# EAGLE design eCog102_uSD (EAGLE 6.6.0)
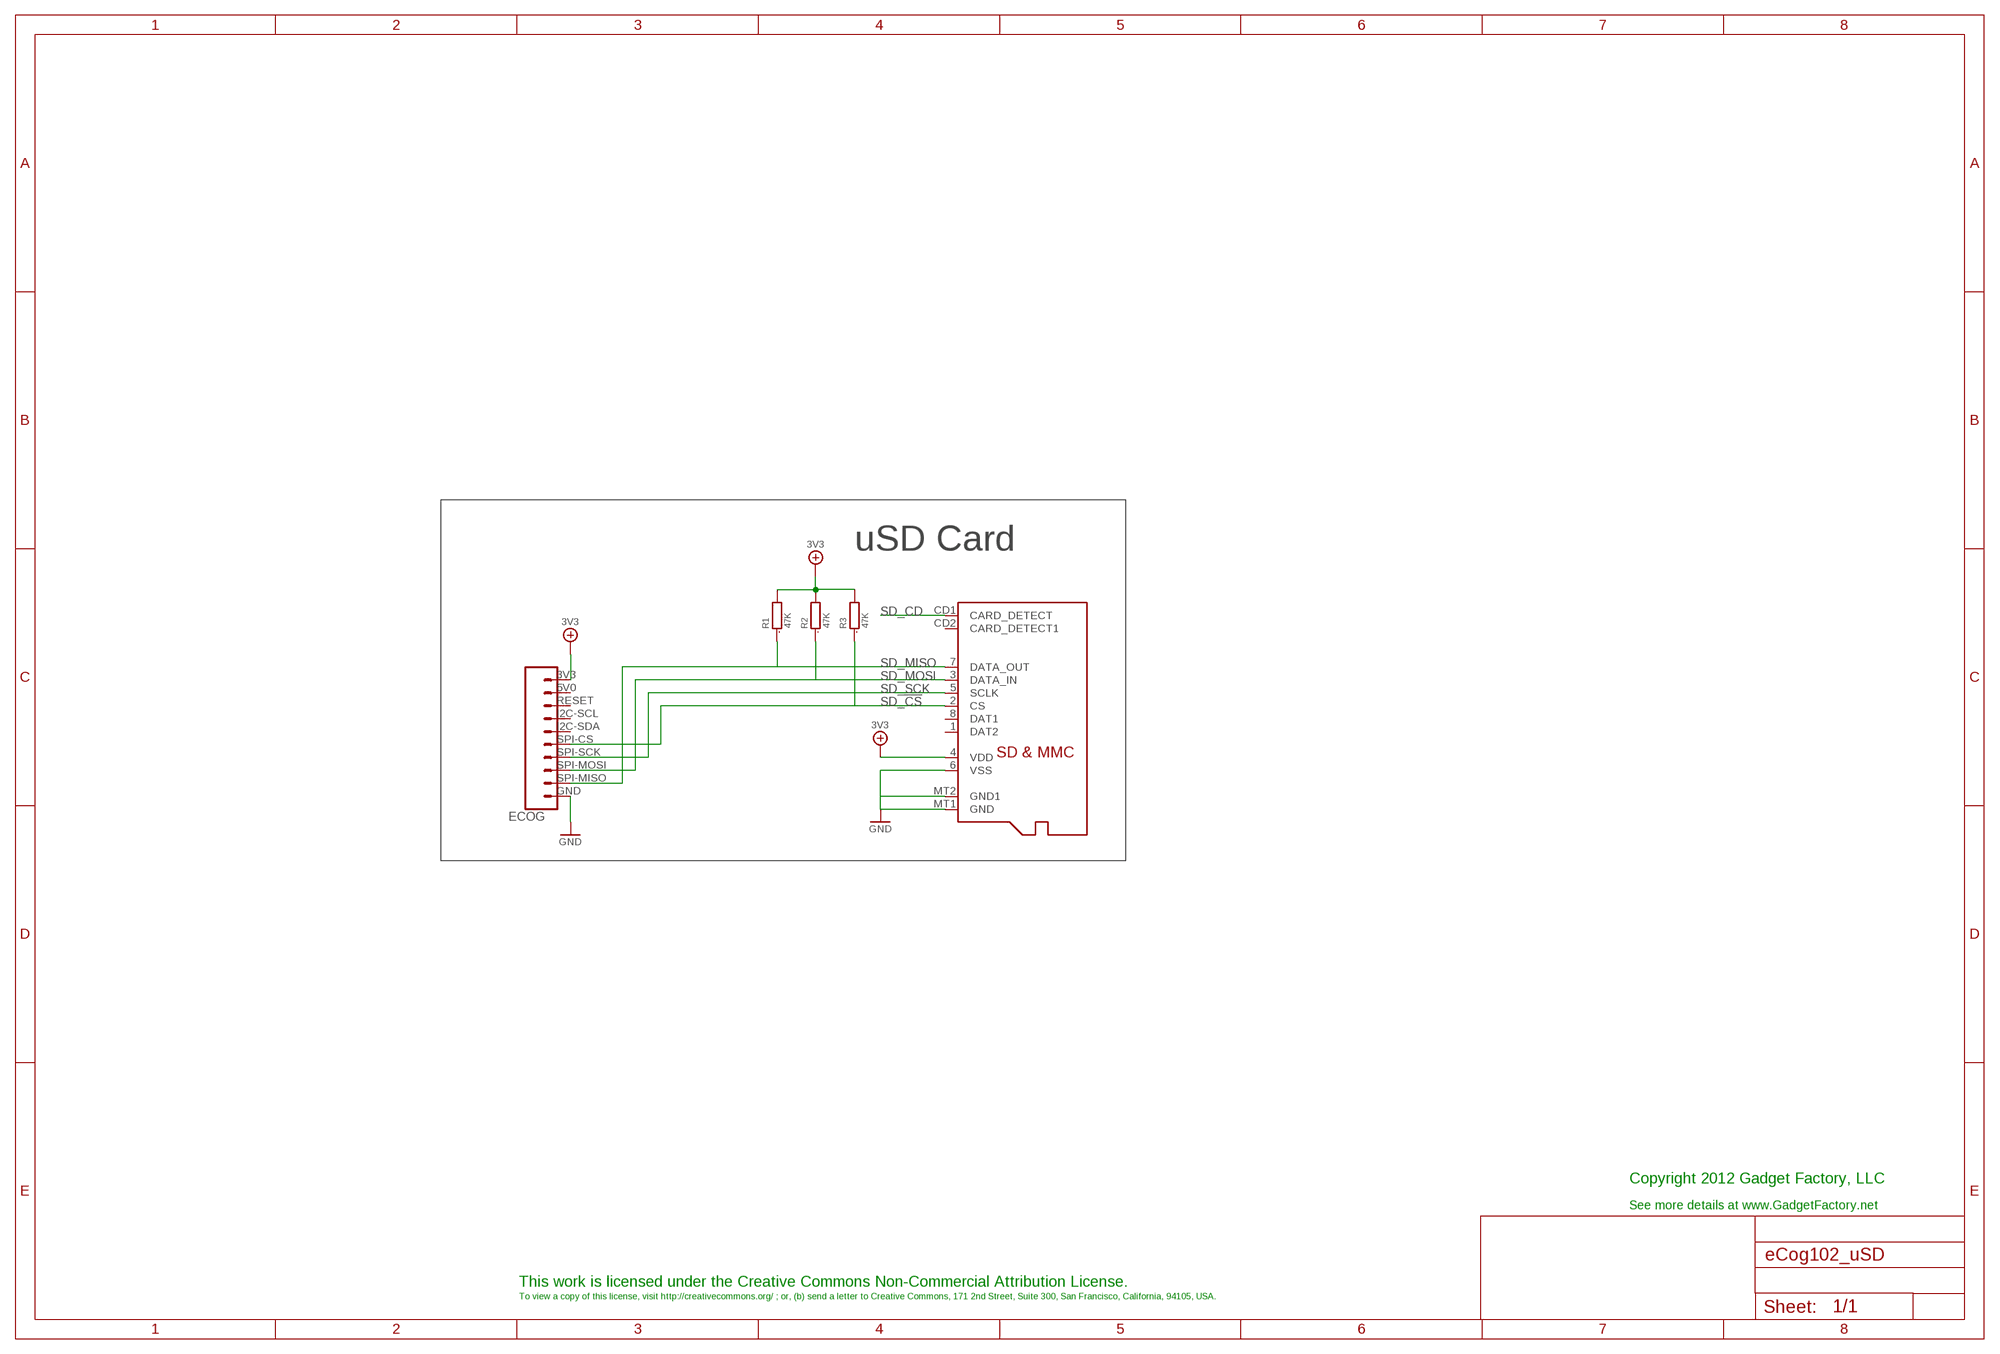
[diagram p0: schematic, sheet 1]

## Parts
ECOG  ECOG_BUSES_ROWTHROUGHHOLE  [ECOG_BUSES_TH]
R1  47K  R0805  [0805]
R2  47K  R0805  [0805]
R3  47K  R0805  [0805]
SD1  MICROSD  [MICROSD]

## Nets
3V3: ECOG.3V3 R1.2 R2.2 R3.2 SD1.4(VDD)
GND: ECOG.GND SD1.6(VSS) SD1.MT1(GND) SD1.MT2(GND1)
SD_!CS: ECOG.SPI-CS R3.1 SD1.2(CS)
SD_CD: SD1.CD1(CARD_DETECT)
SD_MISO: ECOG.SPI-MISO R1.1 SD1.7(DATA_OUT)
SD_MOSI: ECOG.SPI-MOSI R2.1 SD1.3(DATA_IN)
SD_SCK: ECOG.SPI-SCK SD1.5(SCLK)
Unconnected: ECOG.5V0(RSV) ECOG.I2C-SCL ECOG.I2C-SDA ECOG.RESET(RSV) SD1.1(DAT2) SD1.8(DAT1) SD1.CD2(CARD_DETECT1)

## Notes on the sheet
- uSD Card
- Copyright 2012 Gadget Factory, LLC
- See more details at www.GadgetFactory.net
- This work is licensed under the Creative Commons Non-Commercial Attribution License.
- To view a copy of this license, visit http://creativecommons.org/ ; or, (b) send a letter to Creative Commons, 171 2nd Street, Suite 300, San Francisco, California, 94105, USA.

## Library data of the parts
ECOG = eCogs:ECOG_BUSES_ROW
R1-R3 = GadgetFactory_6.0:R: RESISTOR, European symbol; DIGIKEY: RMCF0805JT47K0CT-ND; PARTNO: RMCF0805JT47K0
SD1 = adafruit:MICROSD: Micro-SD / Transflash card holder with SPI pinout For the 3M # 2908-05WB-MG and/or 4UCON #19656 push-push type; DIGIKEY: 101-00660-68-6-1-ND; PARTNO: 101-00660-68-6

## Board
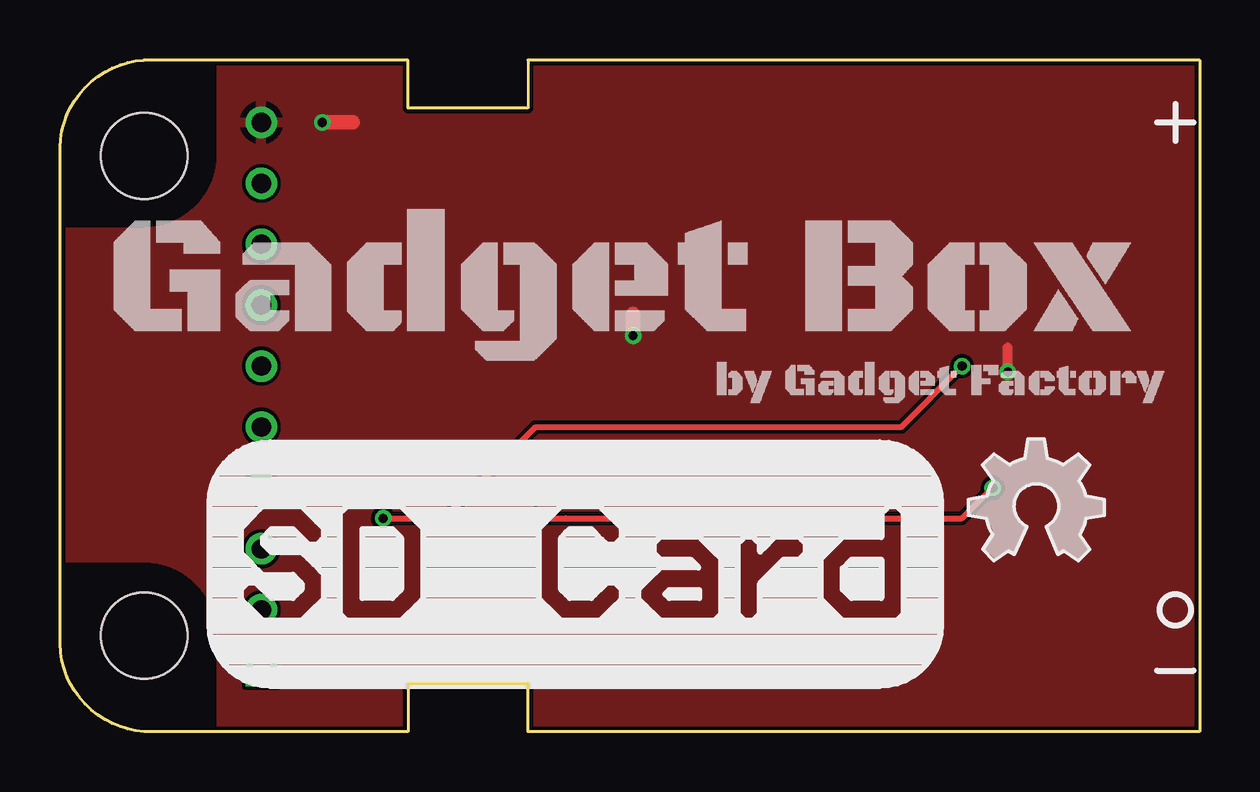
[diagram p1: board, top side]
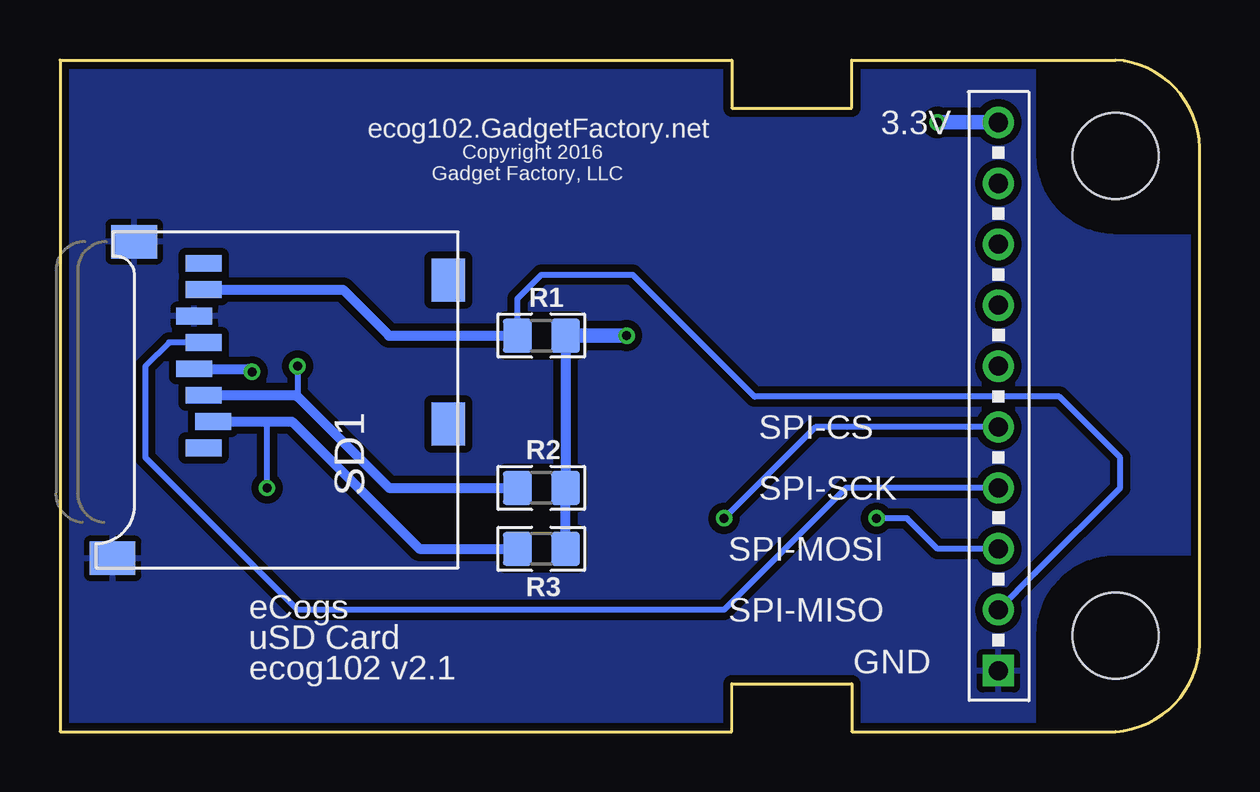
[diagram p2: board, bottom side, seen from below]

Size 47.51 x 28 mm. Coordinates in mm from the lower left corner, seen from the top.
Copper layers (1*16): Top 0.035mm / dielectric 1.5mm / Bottom 0.035mm
Design rules "hackvana": minimum track width 6mil, minimum drill 0.3mm, track to track 6mil, track to pad 6mil, pad to pad 6mil, via to via 6mil, smd to smd 0mil, copper to edge 6mil, drill to drill 6mil, minimum pad ring 10mil, minimum via ring 6mil, stop-mask expansion 2mil, vias tented up to drill 100mil, thermal gap 10mil

### Footprints (pad centres in the part's own frame; a part is rotated, then mirrored left to right if it is on the bottom)
ECOG_BUSES_TH = drill 0.8: 3V3 8.89,25.4; 5V0 8.89,22.86; I2C-SCL 8.89,17.78; I2C-SDA 8.89,15.24; RESET 8.89,20.32; SPI-CS 8.89,12.7; SPI-MISO 8.89,5.08; SPI-MOSI 8.89,7.62; SPI-SCK 8.89,10.16 | drill 0.8 square: GND 8.89,2.54 | hole 3.6: 4.004,24.003; 4.004,4.003
0805 = smd 1.2 x 1.4: 1 -1,0; 2 1,0
MICROSD = smd 0.7 x 1.5: 1 9,-10.64; 2 7.9,-10.24; 3 6.8,-10.64; 4 5.7,-11.04; 5 4.6,-10.64; 6 3.5,-11.04; 7 2.4,-10.64; 8 1.3,-10.64 | smd 1.8 x 1.4: CD1 2,-0.44; CD2 8,-0.44 | smd 1.4 x 1.9: MT1 0.4,-13.54; MT2 13.6,-14.44

### Placement (x,y rotation side)
ECOG  -0.5,0 0 top
R1  27.44,16.51 0 bottom
R2  27.44,10.16 0 bottom
R3  27.44,7.62 0 bottom
SD1  30.87,20.83 270 bottom
U$1  [GADGETBOX_TEXT]  23.51,18.41 0 top
U$2  [OSHW_FILLX200_NOTEXT]  37.86,7.11 0 top

### Tracks (layer width: path | path; a pad name or v marks a point on that pad's centre or on a via)
3V3  (via drill 0.38)
  Top 0.406: v39.5,15 39.5,16
  Top 0.61: v10.93,25.4 12.2,25.4 | v23.89,16.51 23.89,17.4
  Bottom 0.406: R3.2 R2.2 R1.2 | SD1.4 39.63,15.13 v39.5,15
  Bottom 0.61: ECOG.3V3 v10.93,25.4 | R1.2 v23.89,16.51
  pour Top: -1.77,29.27 48.77,29.27 48.77,-1.27 -1.77,-1.27
GND
  pour Bottom (isolate 0.305): -3.04,30.54 50.04,30.54 50.04,-2.54 -3.04,-2.54
SD_!CS  (via drill 0.38)
  Top 0.254: v38.87,10.16 37.6,8.89 21.09,8.89 v19.82,8.89
  Bottom 0.254: v38.87,10.16 38.87,12.93 | ECOG.SPI-CS 16.01,12.7 v19.82,8.89
  Bottom 0.406: SD1.2 38.87,12.93 37.83,12.93 32.52,7.62 R3.1
SD_MISO
  Bottom 0.254: 28.71,16.78 R1.1 28.44,18.05 27.44,19.05 23.63,19.05 18.55,13.97 5.85,13.97 3.31,11.43 3.31,10.16 6.84,6.63 ECOG.SPI-MISO
  Bottom 0.406: SD1.7 35.71,18.43 33.79,16.51 R1.1
SD_MOSI  (via drill 0.38)
  Top 0.254: v37.6,15.24 35.06,12.7 19.82,12.7 16.01,8.89 v13.47,8.89
  Bottom 0.254: v37.6,15.24 37.6,13.97 | ECOG.SPI-MOSI 10.93,7.62 12.2,8.89 v13.47,8.89
  Bottom 0.406: SD1.3 37.66,14.03 37.6,13.97 33.79,10.16 R2.1
SD_SCK
  Bottom 0.254: SD1.5 42.97,16.23 43.95,15.24 43.95,11.43 37.6,5.08 19.82,5.08 14.74,10.16 ECOG.SPI-SCK

### Text on the board
bPlace: 3.3V | ecog102.GadgetFactory.net | Copyright 2016 | Gadget Factory, LLC | SPI-CS | SPI-SCK | SPI-MOSI | SPI-MISO | eCogs | uSD Card | GND | ecog102 v2.1